# Altium schematic sheet FPGA_GTX.SchDoc
size A3
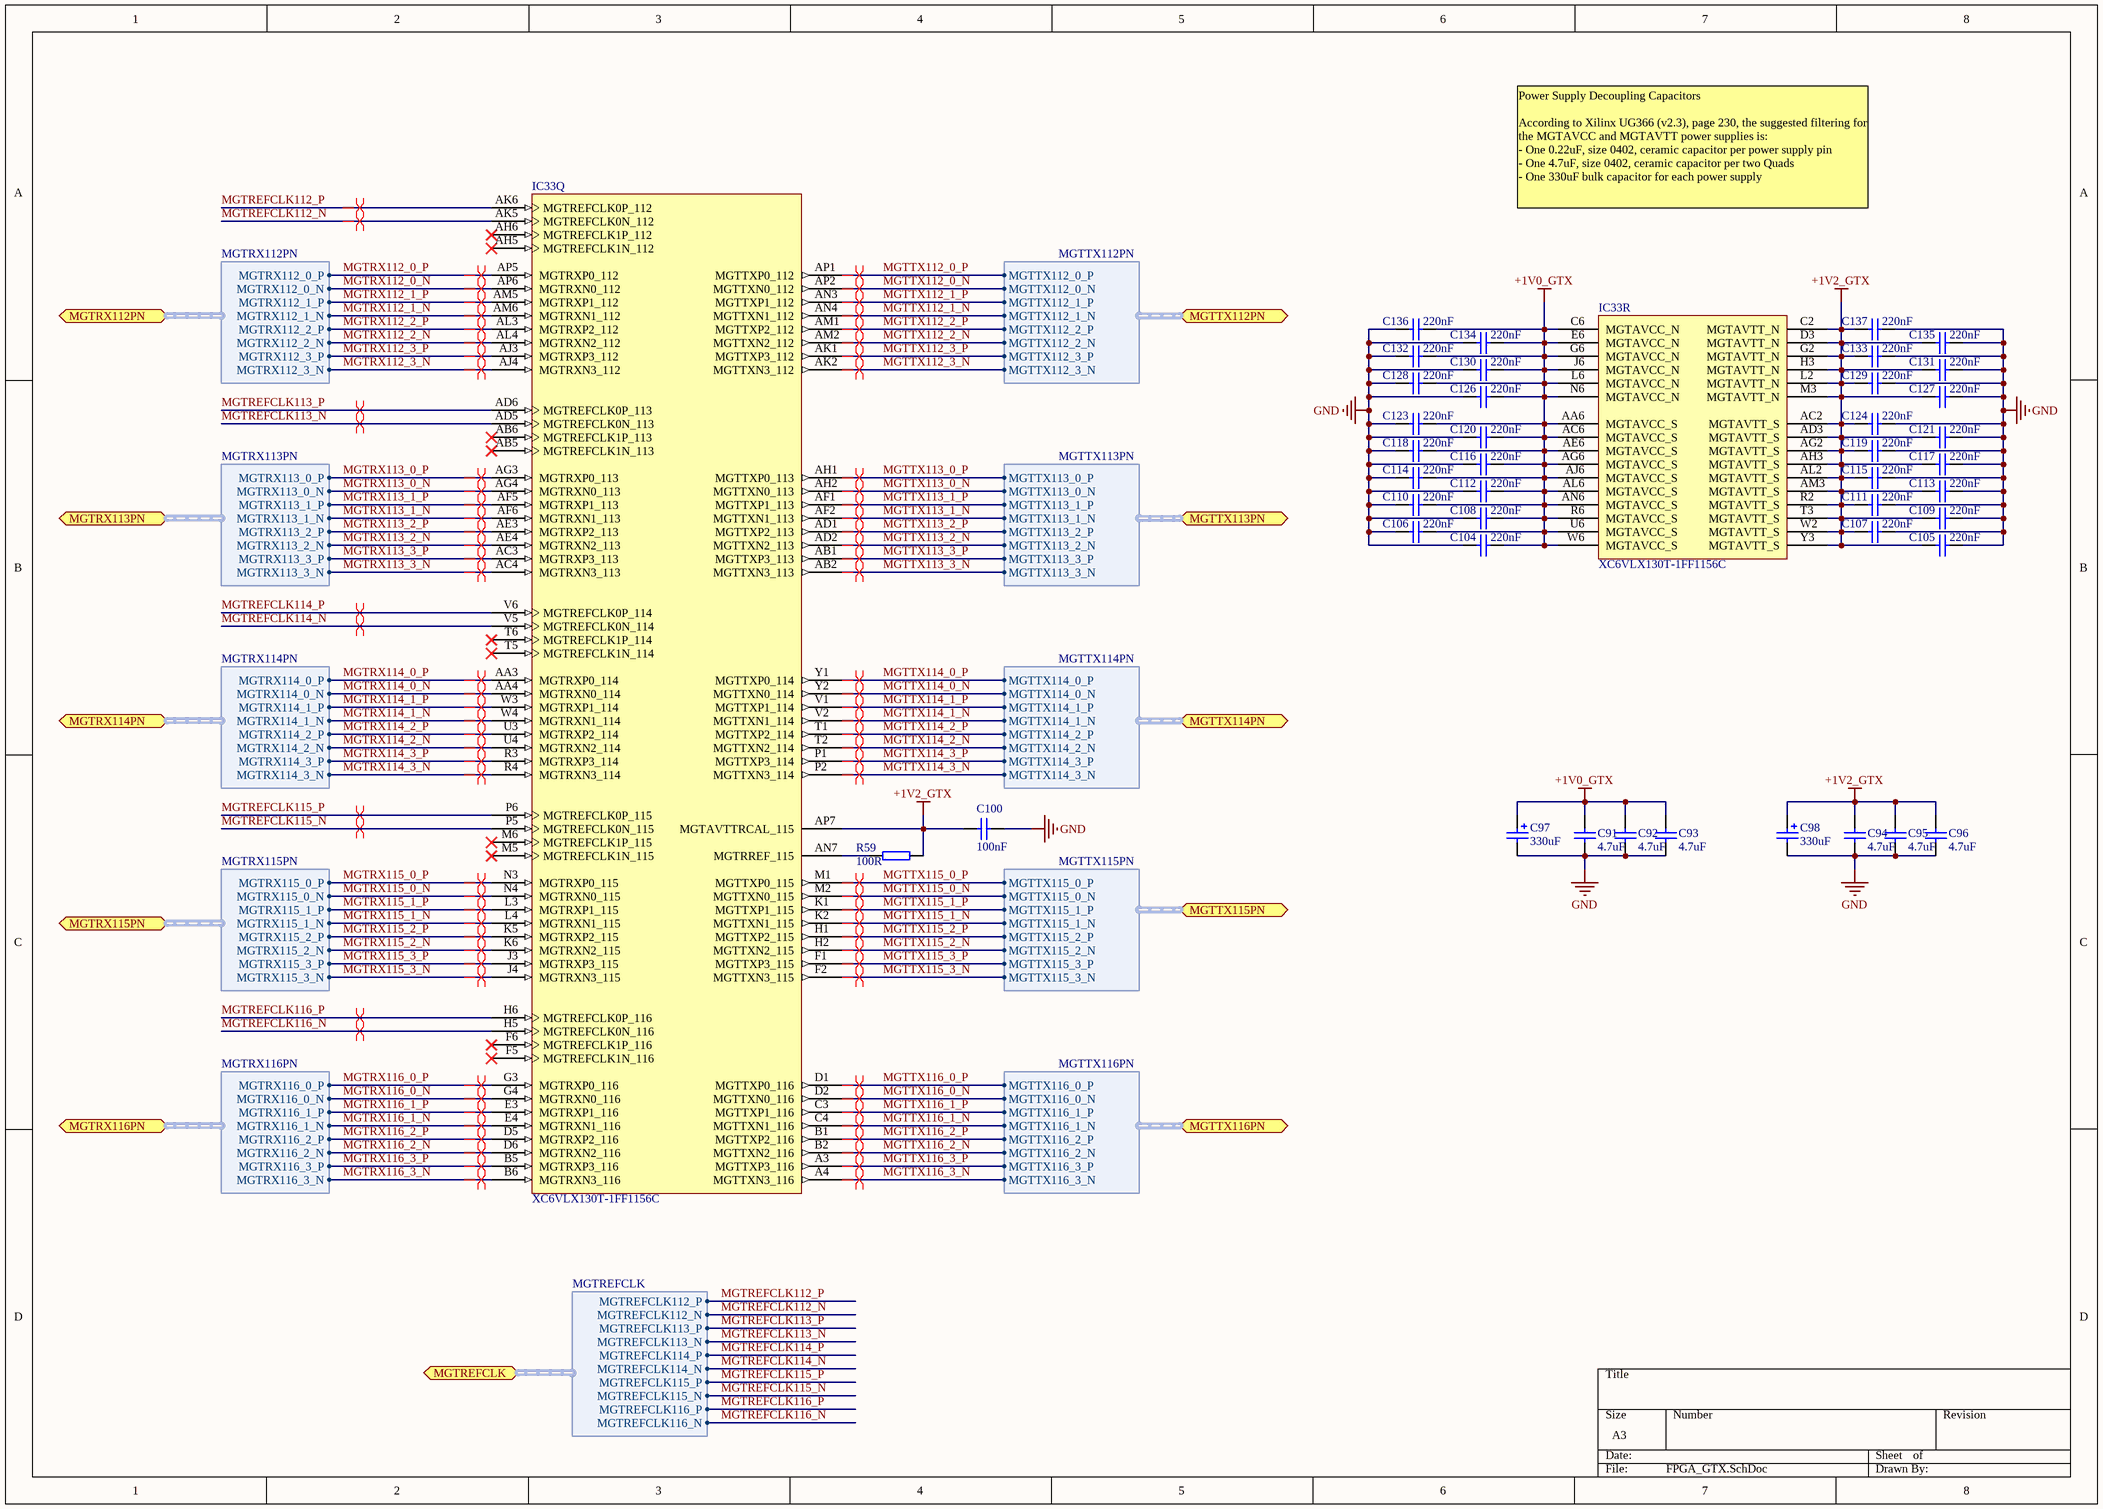
[diagram p0: FPGA_GTX.SchDoc]

## Parts
C91  4.7uF  [CC1608-0603]
C92  4.7uF  [CC1608-0603]
C93  4.7uF  [CC1608-0603]
C94  4.7uF  [CC1608-0603]
C95  4.7uF  [CC1608-0603]
C96  4.7uF  [CC1608-0603]
C97  330uF  [D]
C98  330uF  [D]
C100  100nF  [CC1005-0402]
C104  220nF  [CC1005-0402]
C105  220nF  [CC1005-0402]
C106  220nF  [CC1005-0402]
C107  220nF  [CC1005-0402]
C108  220nF  [CC1005-0402]
C109  220nF  [CC1005-0402]
C110  220nF  [CC1005-0402]
C111  220nF  [CC1005-0402]
C112  220nF  [CC1005-0402]
C113  220nF  [CC1005-0402]
C114  220nF  [CC1005-0402]
C115  220nF  [CC1005-0402]
C116  220nF  [CC1005-0402]
C117  220nF  [CC1005-0402]
C118  220nF  [CC1005-0402]
C119  220nF  [CC1005-0402]
C120  220nF  [CC1005-0402]
C121  220nF  [CC1005-0402]
C123  220nF  [CC1005-0402]
C124  220nF  [CC1005-0402]
C126  220nF  [CC1005-0402]
C127  220nF  [CC1005-0402]
C128  220nF  [CC1005-0402]
C129  220nF  [CC1005-0402]
C130  220nF  [CC1005-0402]
C131  220nF  [CC1005-0402]
C132  220nF  [CC1005-0402]
C133  220nF  [CC1005-0402]
C134  220nF  [CC1005-0402]
C135  220nF  [CC1005-0402]
C136  220nF  [CC1005-0402]
C137  220nF  [CC1005-0402]
IC33  XC6VLX130T-1FF1156C  [FF1156]  (parts Q,R of 20)
R59  100R  [0402]

## Ports
MGTREFCLK (harness MGTREFCLK), MGTRX112PN (harness MGTRX112PN), MGTRX113PN (harness MGTRX113PN), MGTRX114PN (harness MGTRX114PN), MGTRX115PN (harness MGTRX115PN), MGTRX116PN (harness MGTRX116PN), MGTTX112PN (harness MGTTX112PN), MGTTX113PN (harness MGTTX113PN), MGTTX114PN (harness MGTTX114PN), MGTTX115PN (harness MGTTX115PN), MGTTX116PN (harness MGTTX116PN)

## Harnesses
MGTREFCLK: MGTREFCLK112_P, MGTREFCLK112_N, MGTREFCLK113_P, MGTREFCLK113_N, MGTREFCLK114_P, MGTREFCLK114_N, MGTREFCLK115_P, MGTREFCLK115_N, MGTREFCLK116_P, MGTREFCLK116_N
MGTRX116PN: MGTRX116_0_P, MGTRX116_0_N, MGTRX116_1_P, MGTRX116_1_N, MGTRX116_2_P, MGTRX116_2_N, MGTRX116_3_P, MGTRX116_3_N
MGTRX115PN: MGTRX115_0_P, MGTRX115_0_N, MGTRX115_1_P, MGTRX115_1_N, MGTRX115_2_P, MGTRX115_2_N, MGTRX115_3_P, MGTRX115_3_N
MGTRX114PN: MGTRX114_0_P, MGTRX114_0_N, MGTRX114_1_P, MGTRX114_1_N, MGTRX114_2_P, MGTRX114_2_N, MGTRX114_3_P, MGTRX114_3_N
MGTRX113PN: MGTRX113_0_P, MGTRX113_0_N, MGTRX113_1_P, MGTRX113_1_N, MGTRX113_2_P, MGTRX113_2_N, MGTRX113_3_P, MGTRX113_3_N
MGTRX112PN: MGTRX112_0_P, MGTRX112_0_N, MGTRX112_1_P, MGTRX112_1_N, MGTRX112_2_P, MGTRX112_2_N, MGTRX112_3_P, MGTRX112_3_N
MGTTX112PN: MGTTX112_0_P, MGTTX112_0_N, MGTTX112_1_P, MGTTX112_1_N, MGTTX112_2_P, MGTTX112_2_N, MGTTX112_3_P, MGTTX112_3_N
MGTTX113PN: MGTTX113_0_P, MGTTX113_0_N, MGTTX113_1_P, MGTTX113_1_N, MGTTX113_2_P, MGTTX113_2_N, MGTTX113_3_P, MGTTX113_3_N
MGTTX114PN: MGTTX114_0_P, MGTTX114_0_N, MGTTX114_1_P, MGTTX114_1_N, MGTTX114_2_P, MGTTX114_2_N, MGTTX114_3_P, MGTTX114_3_N
MGTTX115PN: MGTTX115_0_P, MGTTX115_0_N, MGTTX115_1_P, MGTTX115_1_N, MGTTX115_2_P, MGTTX115_2_N, MGTTX115_3_P, MGTTX115_3_N
MGTTX116PN: MGTTX116_0_P, MGTTX116_0_N, MGTTX116_1_P, MGTTX116_1_N, MGTTX116_2_P, MGTTX116_2_N, MGTTX116_3_P, MGTTX116_3_N

## Nets
+1V0_GTX: C91.2 C92.2 C93.2 C97.1 C104.2 C106.2 C108.2 C110.2 C112.2 C114.2 C116.2 C118.2 C120.2 C123.2 C126.2 C128.2 C130.2 C132.2 C134.2 C136.2 IC33.AA6(MGTAVCC_S) IC33.AC6(MGTAVCC_S) IC33.AE6(MGTAVCC_S) IC33.AG6(MGTAVCC_S) IC33.AJ6(MGTAVCC_S) IC33.AL6(MGTAVCC_S) IC33.AN6(MGTAVCC_S) IC33.C6(MGTAVCC_N) IC33.E6(MGTAVCC_N) IC33.G6(MGTAVCC_N) IC33.J6(MGTAVCC_N) IC33.L6(MGTAVCC_N) IC33.N6(MGTAVCC_N) IC33.R6(MGTAVCC_S) IC33.U6(MGTAVCC_S) IC33.W6(MGTAVCC_S)
+1V2_GTX: C94.2 C95.2 C96.2 C98.1 C100.2 C105.1 C107.1 C109.1 C111.1 C113.1 C115.1 C117.1 C119.1 C121.1 C124.1 C127.1 C129.1 C131.1 C133.1 C135.1 C137.1 IC33.AC2(MGTAVTT_S) IC33.AD3(MGTAVTT_S) IC33.AG2(MGTAVTT_S) IC33.AH3(MGTAVTT_S) IC33.AL2(MGTAVTT_S) IC33.AM3(MGTAVTT_S) IC33.AP7(MGTAVTTRCAL_115) IC33.C2(MGTAVTT_N) IC33.D3(MGTAVTT_N) IC33.G2(MGTAVTT_N) IC33.H3(MGTAVTT_N) IC33.L2(MGTAVTT_N) IC33.M3(MGTAVTT_N) IC33.R2(MGTAVTT_S) IC33.T3(MGTAVTT_S) IC33.W2(MGTAVTT_S) IC33.Y3(MGTAVTT_S) R59.1
GND: C91.1 C92.1 C93.1 C94.1 C95.1 C96.1 C97.2 C98.2 C100.1 C104.1 C105.2 C106.1 C107.2 C108.1 C109.2 C110.1 C111.2 C112.1 C113.2 C114.1 C115.2 C116.1 C117.2 C118.1 C119.2 C120.1 C121.2 C123.1 C124.2 C126.1 C127.2 C128.1 C129.2 C130.1 C131.2 C132.1 C133.2 C134.1 C135.2 C136.1 C137.2
MGTREFCLK112_N: IC33.AK5(MGTREFCLK0N_112) ; port MGTREFCLK.MGTREFCLK112_N
MGTREFCLK112_P: IC33.AK6(MGTREFCLK0P_112) ; port MGTREFCLK.MGTREFCLK112_P
MGTREFCLK113_N: IC33.AD5(MGTREFCLK0N_113) ; port MGTREFCLK.MGTREFCLK113_N
MGTREFCLK113_P: IC33.AD6(MGTREFCLK0P_113) ; port MGTREFCLK.MGTREFCLK113_P
MGTREFCLK114_N: IC33.V5(MGTREFCLK0N_114) ; port MGTREFCLK.MGTREFCLK114_N
MGTREFCLK114_P: IC33.V6(MGTREFCLK0P_114) ; port MGTREFCLK.MGTREFCLK114_P
MGTREFCLK115_N: IC33.P5(MGTREFCLK0N_115) ; port MGTREFCLK.MGTREFCLK115_N
MGTREFCLK115_P: IC33.P6(MGTREFCLK0P_115) ; port MGTREFCLK.MGTREFCLK115_P
MGTREFCLK116_N: IC33.H5(MGTREFCLK0N_116) ; port MGTREFCLK.MGTREFCLK116_N
MGTREFCLK116_P: IC33.H6(MGTREFCLK0P_116) ; port MGTREFCLK.MGTREFCLK116_P
MGTRX112_0_N: IC33.AP6(MGTRXN0_112) ; port MGTRX112PN.MGTRX112_0_N
MGTRX112_0_P: IC33.AP5(MGTRXP0_112) ; port MGTRX112PN.MGTRX112_0_P
MGTRX112_1_N: IC33.AM6(MGTRXN1_112) ; port MGTRX112PN.MGTRX112_1_N
MGTRX112_1_P: IC33.AM5(MGTRXP1_112) ; port MGTRX112PN.MGTRX112_1_P
MGTRX112_2_N: IC33.AL4(MGTRXN2_112) ; port MGTRX112PN.MGTRX112_2_N
MGTRX112_2_P: IC33.AL3(MGTRXP2_112) ; port MGTRX112PN.MGTRX112_2_P
MGTRX112_3_N: IC33.AJ4(MGTRXN3_112) ; port MGTRX112PN.MGTRX112_3_N
MGTRX112_3_P: IC33.AJ3(MGTRXP3_112) ; port MGTRX112PN.MGTRX112_3_P
MGTRX113_0_N: IC33.AG4(MGTRXN0_113) ; port MGTRX113PN.MGTRX113_0_N
MGTRX113_0_P: IC33.AG3(MGTRXP0_113) ; port MGTRX113PN.MGTRX113_0_P
MGTRX113_1_N: IC33.AF6(MGTRXN1_113) ; port MGTRX113PN.MGTRX113_1_N
MGTRX113_1_P: IC33.AF5(MGTRXP1_113) ; port MGTRX113PN.MGTRX113_1_P
MGTRX113_2_N: IC33.AE4(MGTRXN2_113) ; port MGTRX113PN.MGTRX113_2_N
MGTRX113_2_P: IC33.AE3(MGTRXP2_113) ; port MGTRX113PN.MGTRX113_2_P
MGTRX113_3_N: IC33.AC4(MGTRXN3_113) ; port MGTRX113PN.MGTRX113_3_N
MGTRX113_3_P: IC33.AC3(MGTRXP3_113) ; port MGTRX113PN.MGTRX113_3_P
MGTRX114_0_N: IC33.AA4(MGTRXN0_114) ; port MGTRX114PN.MGTRX114_0_N
MGTRX114_0_P: IC33.AA3(MGTRXP0_114) ; port MGTRX114PN.MGTRX114_0_P
MGTRX114_1_N: IC33.W4(MGTRXN1_114) ; port MGTRX114PN.MGTRX114_1_N
MGTRX114_1_P: IC33.W3(MGTRXP1_114) ; port MGTRX114PN.MGTRX114_1_P
MGTRX114_2_N: IC33.U4(MGTRXN2_114) ; port MGTRX114PN.MGTRX114_2_N
MGTRX114_2_P: IC33.U3(MGTRXP2_114) ; port MGTRX114PN.MGTRX114_2_P
MGTRX114_3_N: IC33.R4(MGTRXN3_114) ; port MGTRX114PN.MGTRX114_3_N
MGTRX114_3_P: IC33.R3(MGTRXP3_114) ; port MGTRX114PN.MGTRX114_3_P
MGTRX115_0_N: IC33.N4(MGTRXN0_115) ; port MGTRX115PN.MGTRX115_0_N
MGTRX115_0_P: IC33.N3(MGTRXP0_115) ; port MGTRX115PN.MGTRX115_0_P
MGTRX115_1_N: IC33.L4(MGTRXN1_115) ; port MGTRX115PN.MGTRX115_1_N
MGTRX115_1_P: IC33.L3(MGTRXP1_115) ; port MGTRX115PN.MGTRX115_1_P
MGTRX115_2_N: IC33.K6(MGTRXN2_115) ; port MGTRX115PN.MGTRX115_2_N
MGTRX115_2_P: IC33.K5(MGTRXP2_115) ; port MGTRX115PN.MGTRX115_2_P
MGTRX115_3_N: IC33.J4(MGTRXN3_115) ; port MGTRX115PN.MGTRX115_3_N
MGTRX115_3_P: IC33.J3(MGTRXP3_115) ; port MGTRX115PN.MGTRX115_3_P
MGTRX116_0_N: IC33.G4(MGTRXN0_116) ; port MGTRX116PN.MGTRX116_0_N
MGTRX116_0_P: IC33.G3(MGTRXP0_116) ; port MGTRX116PN.MGTRX116_0_P
MGTRX116_1_N: IC33.E4(MGTRXN1_116) ; port MGTRX116PN.MGTRX116_1_N
MGTRX116_1_P: IC33.E3(MGTRXP1_116) ; port MGTRX116PN.MGTRX116_1_P
MGTRX116_2_N: IC33.D6(MGTRXN2_116) ; port MGTRX116PN.MGTRX116_2_N
MGTRX116_2_P: IC33.D5(MGTRXP2_116) ; port MGTRX116PN.MGTRX116_2_P
MGTRX116_3_N: IC33.B6(MGTRXN3_116) ; port MGTRX116PN.MGTRX116_3_N
MGTRX116_3_P: IC33.B5(MGTRXP3_116) ; port MGTRX116PN.MGTRX116_3_P
MGTTX112_0_N: IC33.AP2(MGTTXN0_112) ; port MGTTX112PN.MGTTX112_0_N
MGTTX112_0_P: IC33.AP1(MGTTXP0_112) ; port MGTTX112PN.MGTTX112_0_P
MGTTX112_1_N: IC33.AN4(MGTTXN1_112) ; port MGTTX112PN.MGTTX112_1_N
MGTTX112_1_P: IC33.AN3(MGTTXP1_112) ; port MGTTX112PN.MGTTX112_1_P
MGTTX112_2_N: IC33.AM2(MGTTXN2_112) ; port MGTTX112PN.MGTTX112_2_N
MGTTX112_2_P: IC33.AM1(MGTTXP2_112) ; port MGTTX112PN.MGTTX112_2_P
MGTTX112_3_N: IC33.AK2(MGTTXN3_112) ; port MGTTX112PN.MGTTX112_3_N
MGTTX112_3_P: IC33.AK1(MGTTXP3_112) ; port MGTTX112PN.MGTTX112_3_P
MGTTX113_0_N: IC33.AH2(MGTTXN0_113) ; port MGTTX113PN.MGTTX113_0_N
MGTTX113_0_P: IC33.AH1(MGTTXP0_113) ; port MGTTX113PN.MGTTX113_0_P
MGTTX113_1_N: IC33.AF2(MGTTXN1_113) ; port MGTTX113PN.MGTTX113_1_N
MGTTX113_1_P: IC33.AF1(MGTTXP1_113) ; port MGTTX113PN.MGTTX113_1_P
MGTTX113_2_N: IC33.AD2(MGTTXN2_113) ; port MGTTX113PN.MGTTX113_2_N
MGTTX113_2_P: IC33.AD1(MGTTXP2_113) ; port MGTTX113PN.MGTTX113_2_P
MGTTX113_3_N: IC33.AB2(MGTTXN3_113) ; port MGTTX113PN.MGTTX113_3_N
MGTTX113_3_P: IC33.AB1(MGTTXP3_113) ; port MGTTX113PN.MGTTX113_3_P
MGTTX114_0_N: IC33.Y2(MGTTXN0_114) ; port MGTTX114PN.MGTTX114_0_N
MGTTX114_0_P: IC33.Y1(MGTTXP0_114) ; port MGTTX114PN.MGTTX114_0_P
MGTTX114_1_N: IC33.V2(MGTTXN1_114) ; port MGTTX114PN.MGTTX114_1_N
MGTTX114_1_P: IC33.V1(MGTTXP1_114) ; port MGTTX114PN.MGTTX114_1_P
MGTTX114_2_N: IC33.T2(MGTTXN2_114) ; port MGTTX114PN.MGTTX114_2_N
MGTTX114_2_P: IC33.T1(MGTTXP2_114) ; port MGTTX114PN.MGTTX114_2_P
MGTTX114_3_N: IC33.P2(MGTTXN3_114) ; port MGTTX114PN.MGTTX114_3_N
MGTTX114_3_P: IC33.P1(MGTTXP3_114) ; port MGTTX114PN.MGTTX114_3_P
MGTTX115_0_N: IC33.M2(MGTTXN0_115) ; port MGTTX115PN.MGTTX115_0_N
MGTTX115_0_P: IC33.M1(MGTTXP0_115) ; port MGTTX115PN.MGTTX115_0_P
MGTTX115_1_N: IC33.K2(MGTTXN1_115) ; port MGTTX115PN.MGTTX115_1_N
MGTTX115_1_P: IC33.K1(MGTTXP1_115) ; port MGTTX115PN.MGTTX115_1_P
MGTTX115_2_N: IC33.H2(MGTTXN2_115) ; port MGTTX115PN.MGTTX115_2_N
MGTTX115_2_P: IC33.H1(MGTTXP2_115) ; port MGTTX115PN.MGTTX115_2_P
MGTTX115_3_N: IC33.F2(MGTTXN3_115) ; port MGTTX115PN.MGTTX115_3_N
MGTTX115_3_P: IC33.F1(MGTTXP3_115) ; port MGTTX115PN.MGTTX115_3_P
MGTTX116_0_N: IC33.D2(MGTTXN0_116) ; port MGTTX116PN.MGTTX116_0_N
MGTTX116_0_P: IC33.D1(MGTTXP0_116) ; port MGTTX116PN.MGTTX116_0_P
MGTTX116_1_N: IC33.C4(MGTTXN1_116) ; port MGTTX116PN.MGTTX116_1_N
MGTTX116_1_P: IC33.C3(MGTTXP1_116) ; port MGTTX116PN.MGTTX116_1_P
MGTTX116_2_N: IC33.B2(MGTTXN2_116) ; port MGTTX116PN.MGTTX116_2_N
MGTTX116_2_P: IC33.B1(MGTTXP2_116) ; port MGTTX116PN.MGTTX116_2_P
MGTTX116_3_N: IC33.A4(MGTTXN3_116) ; port MGTTX116PN.MGTTX116_3_N
MGTTX116_3_P: IC33.A3(MGTTXP3_116) ; port MGTTX116PN.MGTTX116_3_P
NetIC33_AN7: IC33.AN7(MGTRREF_115) R59.2

Not connected (* = marked no-connect by the designer): IC33 AB5(MGTREFCLK1N_113)* AB6(MGTREFCLK1P_113)* AH5(MGTREFCLK1N_112)* AH6(MGTREFCLK1P_112)* F5(MGTREFCLK1N_116)* F6(MGTREFCLK1P_116)* M5(MGTREFCLK1N_115)* M6(MGTREFCLK1P_115)* T5(MGTREFCLK1N_114)* T6(MGTREFCLK1P_114)*

## Layout directives
differential pair: MGTREFCLK112_N, MGTREFCLK112_P, MGTREFCLK113_N, MGTREFCLK113_P, MGTREFCLK114_N, MGTREFCLK114_P, MGTREFCLK115_N, MGTREFCLK115_P, MGTREFCLK116_N, MGTREFCLK116_P, MGTRX112_0_N, MGTRX112_0_P, MGTRX112_1_N, MGTRX112_1_P, MGTRX112_2_N, MGTRX112_2_P, MGTRX112_3_N, MGTRX112_3_P, MGTRX113_0_N, MGTRX113_0_P, MGTRX113_1_N, MGTRX113_1_P, MGTRX113_2_N, MGTRX113_2_P, MGTRX113_3_N, MGTRX113_3_P, MGTRX114_0_N, MGTRX114_0_P, MGTRX114_1_N, MGTRX114_1_P, MGTRX114_2_N, MGTRX114_2_P, MGTRX114_3_N, MGTRX114_3_P, MGTRX115_0_N, MGTRX115_0_P, MGTRX115_1_N, MGTRX115_1_P, MGTRX115_2_N, MGTRX115_2_P, MGTRX115_3_N, MGTRX115_3_P, MGTRX116_0_N, MGTRX116_0_P, MGTRX116_1_N, MGTRX116_1_P, MGTRX116_2_N, MGTRX116_2_P, MGTRX116_3_N, MGTRX116_3_P, MGTTX112_0_N, MGTTX112_0_P, MGTTX112_1_N, MGTTX112_1_P, MGTTX112_2_N, MGTTX112_2_P, MGTTX112_3_N, MGTTX112_3_P, MGTTX113_0_N, MGTTX113_0_P, MGTTX113_1_N, MGTTX113_1_P, MGTTX113_2_N, MGTTX113_2_P, MGTTX113_3_N, MGTTX113_3_P, MGTTX114_0_N, MGTTX114_0_P, MGTTX114_1_N, MGTTX114_1_P, MGTTX114_2_N, MGTTX114_2_P, MGTTX114_3_N, MGTTX114_3_P, MGTTX115_0_N, MGTTX115_0_P, MGTTX115_1_N, MGTTX115_1_P, MGTTX115_2_N, MGTTX115_2_P, MGTTX115_3_N, MGTTX115_3_P, MGTTX116_0_N, MGTTX116_0_P, MGTTX116_1_N, MGTTX116_1_P, MGTTX116_2_N, MGTTX116_2_P, MGTTX116_3_N, MGTTX116_3_P

## Notes on the sheet
- Power Supply Decoupling Capacitors
  According to Xilinx UG366 (v2.3), page 230, the suggested filtering for the MGTAVCC and MGTAVTT power supplies is:
  - One 0.22uF, size 0402, ceramic capacitor per power supply pin
  - One 4.7uF, size 0402, ceramic capacitor per two Quads
  - One 330uF bulk capacitor for each power supply

## Library data of the parts
C91-C96 = CC0603_4.7UF_10V_10%_X5R: Capacitor; Manufacturer1: TDK; Manufacturer1 PN: C1608X5R1A475K; TC: X5R; Tolerance: ±10%; Voltage: 10V; Published: 8-Jun-2000; LatestRevisionDate: 17-Jul-2002; LatestRevisionNote: Re-released for DXP Platform.; PackageReference: RAD-0.3; Publisher: Altium Limited; Distributor1: Digikey; Distributor1 PN: 445-5170-1-ND; Case: 0603; Value: 4.7uF
C97 C98 = CP2917_330UF_6.3V_20%_TANT: Polarized Capacitor Tantalum; Manufacturer1: Kemet; Manufacturer1 PN: T520D337M006ATE025; Tolerance: ±20%; Voltage: 6.3V; ESR: 25mOhm; Published: 8-Jun-2000; LatestRevisionDate: 17-Jul-2002; LatestRevisionNote: Re-released for DXP Platform.; PackageReference: RB7.6-15; Publisher: Altium Limited; Case: 2917; Distributor1: Digikey; Distributor1 PN: 399-4053-1-ND; TC: Tantalum; Value: 330uF
C100 = CC0402_100NF_16V_10%_X7R: Capacitor; Manufacturer1: TDK; Manufacturer1 PN: C1005X7R1C104K; TC: X7R; Tolerance: ±10%; Voltage: 16V; Published: 8-Jun-2000; LatestRevisionDate: 17-Jul-2002; LatestRevisionNote: Re-released for DXP Platform.; PackageReference: RAD-0.3; Publisher: Altium Limited; Distributor1: Digikey; Distributor1 PN: 445-4952-1-ND; Case: 0402; Value: 100nF
C104-C121 C123 C124 C126-C137 = CC0402_220NF_16V_10%_X7R: Capacitor; Manufacturer1: TDK; Manufacturer1 PN: C1005X7R1C224K; TC: X7R; Tolerance: ±10%; Voltage: 16V; Published: 8-Jun-2000; LatestRevisionDate: 17-Jul-2002; LatestRevisionNote: Re-released for DXP Platform.; PackageReference: RAD-0.3; Publisher: Altium Limited; Distributor1: Digikey; Distributor1 PN: 445-5936-1-ND; Case: 0402; Value: 220nF
IC33 = XC6VLX130T-1FF1156C: Virtex-6 LXT Platform FPGA, 600 User I/Os, 20 GTXs, 1156-Ball FFBGA, Speed Grade 1, Commercial Grade; FirstPublished: 17-Nov-2009; DatasheetVersion: v2.0, Sep-2009; PackageVersion: ver1.0, Jun-2009; PackageReference: FF1156; Publisher: Altium Limited; PackageDescription: 1156-Ball Flip-Chip Fine Pitch Ball Grid Array (FF1156); Code_JEDEC: MS-034-AAR-1; Code_IPC: BGA100P34X34-1156; ComponentLink1Description: Virtex-6 Datasheet; ComponentLink1URL: http://www.xilinx.com/support/documentation/data_sheets/ds150.pdf; ComponentLink2Description: Pinout Specification; ComponentLink2URL: http://www.xilinx.com/support/packagefiles/virtex-6-pkgs.htm; ComponentLink3Description: FF1156 Package Drawing; ComponentLink3URL: http://www.xilinx.com/support/documentation/package_specs/ff1156.pdf; ComponentLink4Description: Virtex-6 Documents; ComponentLink4URL: http://www.xilinx.com/support/documentation/virtex-6.htm; ComponentLink5Description: Xilinx.com Home; ComponentLink5URL: http://www.xilinx.com
R59 = R0402_100R_±1%_0.1W_100PPM: SMD Resistor; Manufacturer1: Panasonic; Manufacturer1 PN: ERJ-2RKF1000X; TCR: 100ppm; Power Rating: 0.1W; Tolerance: ±1%; Case: 0402; Distributor1: DigiKey; Distributor1 PN: P100LCT-ND; Value: 100R